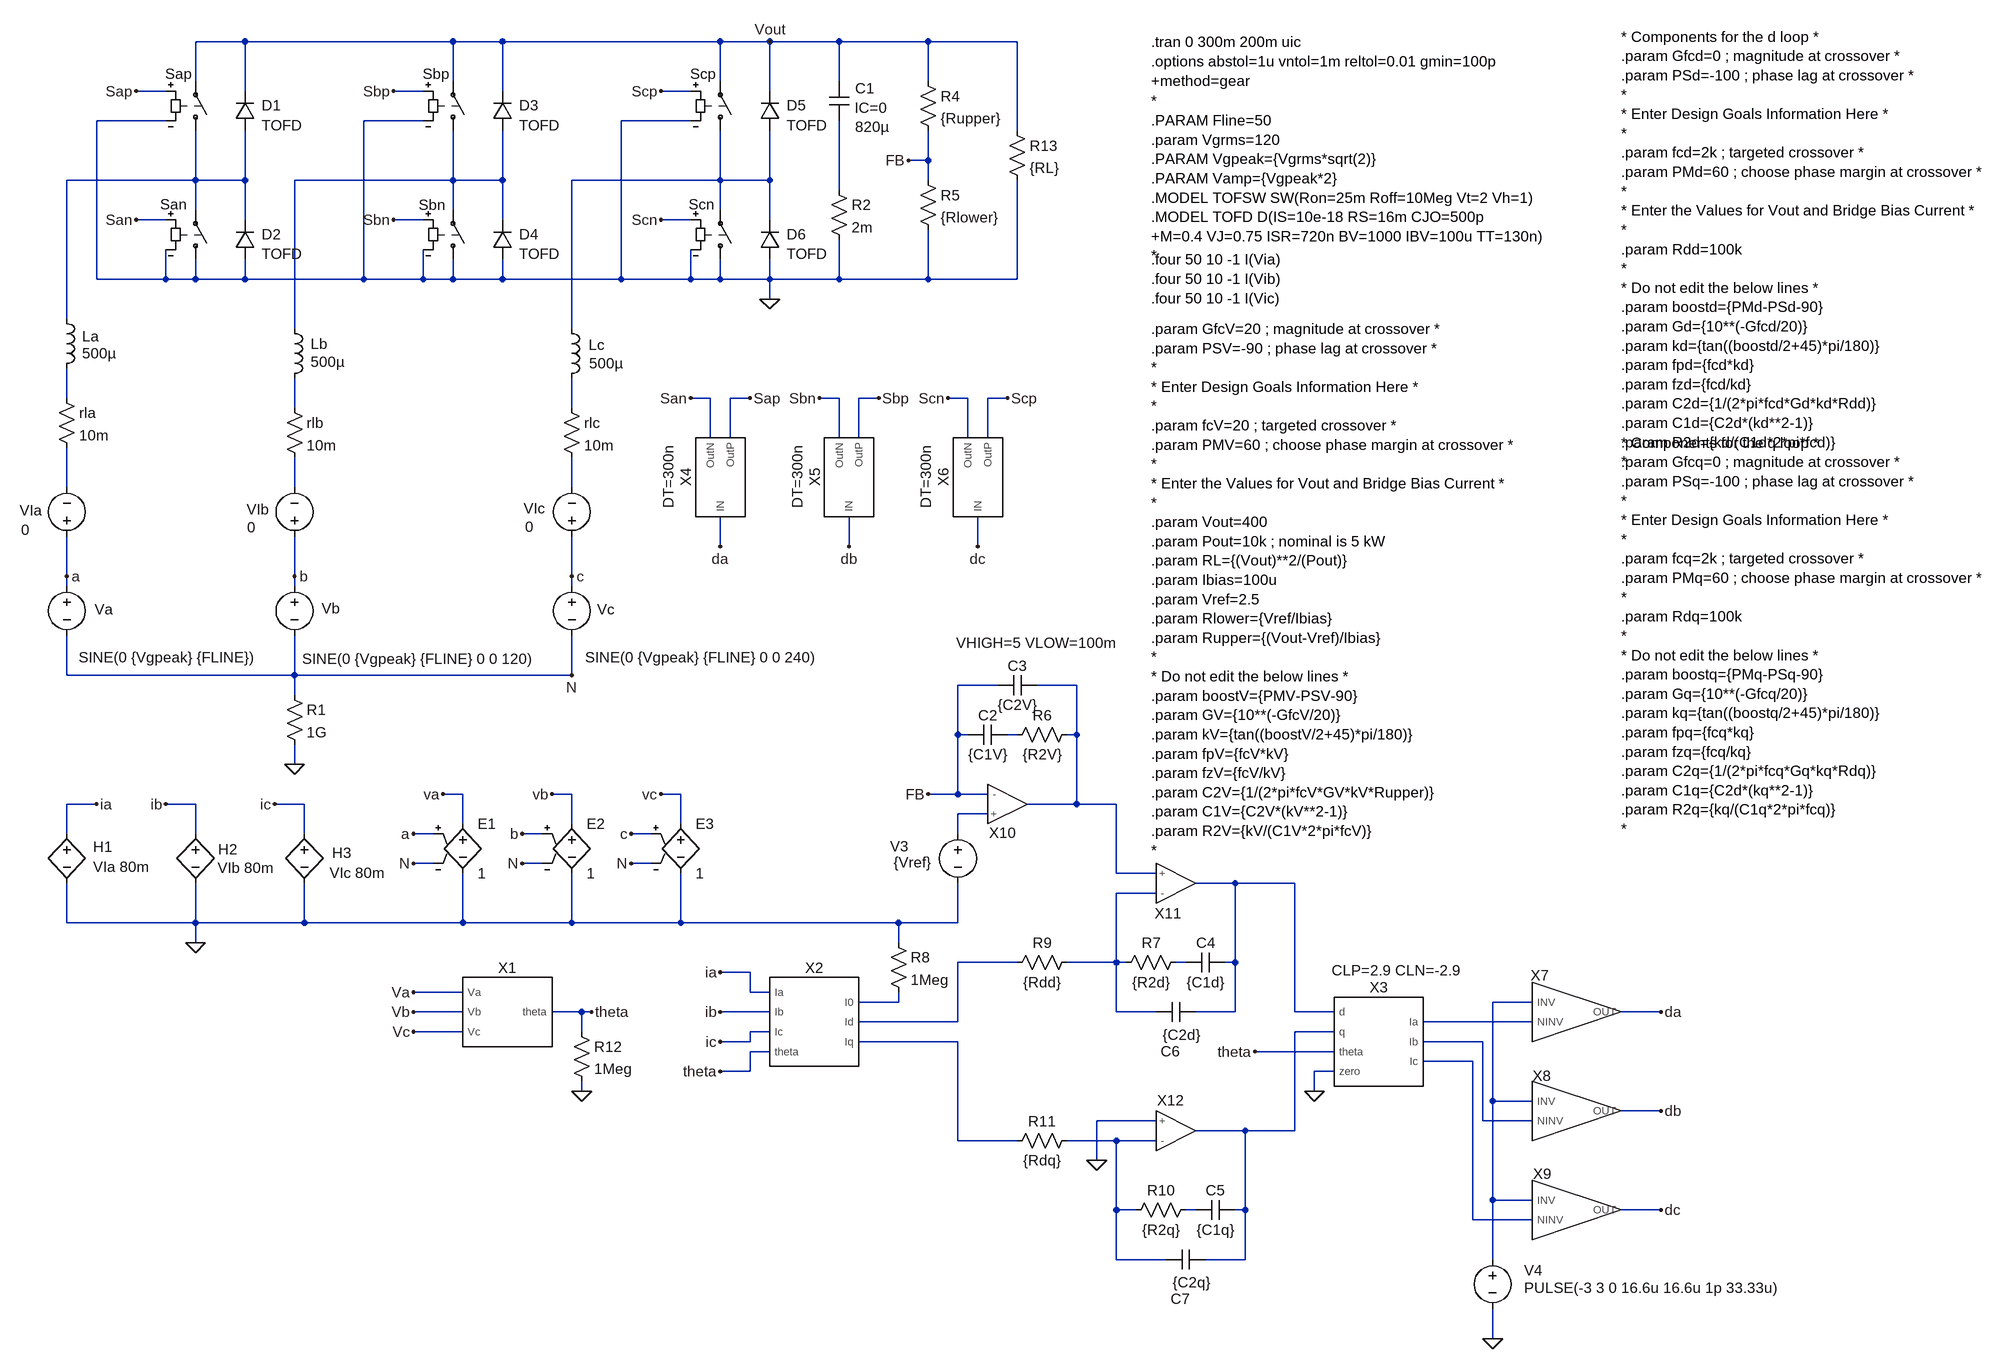
[diagram p0: schematic 3-phase PFC with switches.asc]
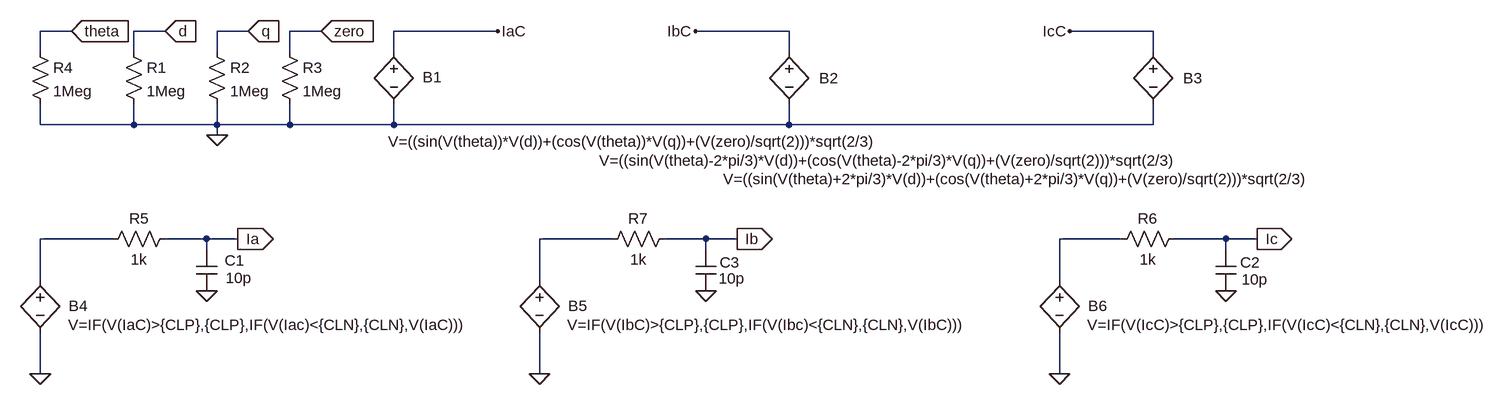
[diagram p1: sub-circuit inverse_dq0.asc]
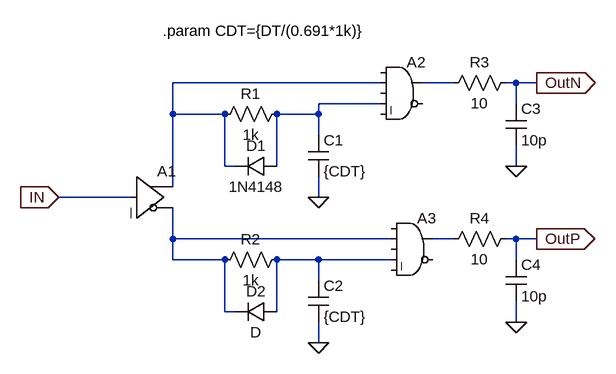
[diagram p2: sub-circuit dt_driver.asc]
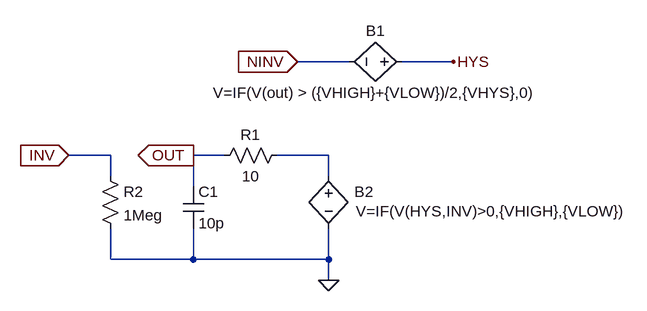
[diagram p3: sub-circuit comptof.asc]
3-phase PFC with switches.asc, the LTspice schematic file:
Version 4
SHEET 1 4316 1596
WIRE 320 -688 240 -688
WIRE 656 -688 320 -688
WIRE 736 -688 656 -688
WIRE 1088 -688 736 -688
WIRE 1168 -688 1088 -688
WIRE 1280 -688 1168 -688
WIRE 1424 -688 1280 -688
WIRE 1568 -688 1424 -688
WIRE 240 -624 240 -688
WIRE 656 -624 656 -688
WIRE 1088 -624 1088 -688
WIRE 1280 -624 1280 -688
WIRE 1424 -624 1424 -688
WIRE 192 -608 144 -608
WIRE 320 -608 320 -688
WIRE 608 -608 560 -608
WIRE 736 -608 736 -688
WIRE 1040 -608 992 -608
WIRE 1168 -608 1168 -688
WIRE 192 -560 80 -560
WIRE 608 -560 512 -560
WIRE 1040 -560 928 -560
WIRE 1568 -544 1568 -688
WIRE 1424 -496 1424 -544
WIRE 1424 -496 1392 -496
WIRE 240 -464 240 -544
WIRE 240 -464 32 -464
WIRE 320 -464 320 -544
WIRE 320 -464 240 -464
WIRE 656 -464 656 -544
WIRE 656 -464 400 -464
WIRE 736 -464 736 -544
WIRE 736 -464 656 -464
WIRE 1088 -464 1088 -544
WIRE 1088 -464 848 -464
WIRE 1168 -464 1168 -544
WIRE 1168 -464 1088 -464
WIRE 1424 -464 1424 -496
WIRE 1280 -448 1280 -560
WIRE 240 -416 240 -464
WIRE 656 -416 656 -464
WIRE 1088 -416 1088 -464
WIRE 192 -400 144 -400
WIRE 320 -400 320 -464
WIRE 608 -400 560 -400
WIRE 736 -400 736 -464
WIRE 1040 -400 992 -400
WIRE 1168 -400 1168 -464
WIRE 80 -304 80 -560
WIRE 192 -304 192 -352
WIRE 192 -304 80 -304
WIRE 240 -304 240 -336
WIRE 240 -304 192 -304
WIRE 320 -304 320 -336
WIRE 320 -304 240 -304
WIRE 512 -304 512 -560
WIRE 512 -304 320 -304
WIRE 608 -304 608 -352
WIRE 608 -304 512 -304
WIRE 656 -304 656 -336
WIRE 656 -304 608 -304
WIRE 736 -304 736 -336
WIRE 736 -304 656 -304
WIRE 928 -304 928 -560
WIRE 928 -304 736 -304
WIRE 1040 -304 1040 -352
WIRE 1040 -304 928 -304
WIRE 1088 -304 1088 -336
WIRE 1088 -304 1040 -304
WIRE 1168 -304 1168 -336
WIRE 1168 -304 1088 -304
WIRE 1280 -304 1280 -368
WIRE 1280 -304 1168 -304
WIRE 1424 -304 1424 -384
WIRE 1424 -304 1280 -304
WIRE 1568 -304 1568 -464
WIRE 1568 -304 1424 -304
WIRE 1168 -272 1168 -304
WIRE 32 -240 32 -464
WIRE 400 -224 400 -464
WIRE 848 -224 848 -464
WIRE 32 -112 32 -160
WIRE 1072 -112 1040 -112
WIRE 1136 -112 1104 -112
WIRE 1280 -112 1248 -112
WIRE 1344 -112 1312 -112
WIRE 1488 -112 1456 -112
WIRE 1552 -112 1520 -112
WIRE 400 -96 400 -144
WIRE 848 -96 848 -144
WIRE 1072 -48 1072 -112
WIRE 1104 -48 1104 -112
WIRE 1280 -48 1280 -112
WIRE 1312 -48 1312 -112
WIRE 1488 -48 1488 -112
WIRE 1520 -48 1520 -112
WIRE 32 32 32 -32
WIRE 400 32 400 -16
WIRE 848 32 848 -16
WIRE 1088 128 1088 80
WIRE 1296 128 1296 80
WIRE 1504 128 1504 80
WIRE 32 176 32 112
WIRE 400 176 400 112
WIRE 848 176 848 112
WIRE 32 192 32 176
WIRE 400 192 400 176
WIRE 848 192 848 176
WIRE 32 336 32 272
WIRE 400 336 400 272
WIRE 400 336 32 336
WIRE 848 336 848 272
WIRE 848 336 400 336
WIRE 1536 352 1472 352
WIRE 1664 352 1600 352
WIRE 400 368 400 336
WIRE 1472 432 1472 352
WIRE 1488 432 1472 432
WIRE 1568 432 1552 432
WIRE 1664 432 1664 352
WIRE 1664 432 1648 432
WIRE 400 480 400 448
WIRE 672 528 640 528
WIRE 848 528 816 528
WIRE 1024 528 992 528
WIRE 1472 528 1472 432
WIRE 1472 528 1424 528
WIRE 1520 528 1472 528
WIRE 80 544 32 544
WIRE 240 544 192 544
WIRE 416 544 368 544
WIRE 1664 544 1664 432
WIRE 1664 544 1584 544
WIRE 1728 544 1664 544
WIRE 1520 560 1472 560
WIRE 672 576 672 528
WIRE 848 576 848 528
WIRE 1024 576 1024 528
WIRE 32 592 32 544
WIRE 240 592 240 544
WIRE 416 592 416 544
WIRE 624 592 592 592
WIRE 800 592 768 592
WIRE 976 592 944 592
WIRE 1472 592 1472 560
WIRE 624 640 592 640
WIRE 800 640 768 640
WIRE 976 640 944 640
WIRE 1728 656 1728 544
WIRE 1792 656 1728 656
WIRE 1920 672 1856 672
WIRE 2016 672 1920 672
WIRE 1792 688 1728 688
WIRE 32 736 32 672
WIRE 240 736 240 672
WIRE 240 736 32 736
WIRE 416 736 416 672
WIRE 416 736 240 736
WIRE 672 736 672 656
WIRE 672 736 416 736
WIRE 848 736 848 656
WIRE 848 736 672 736
WIRE 1024 736 1024 656
WIRE 1024 736 848 736
WIRE 1376 736 1024 736
WIRE 1472 736 1472 672
WIRE 1472 736 1376 736
WIRE 240 768 240 736
WIRE 1376 768 1376 736
WIRE 1568 800 1472 800
WIRE 1728 800 1728 688
WIRE 1728 800 1648 800
WIRE 1744 800 1728 800
WIRE 1840 800 1824 800
WIRE 1920 800 1920 672
WIRE 1920 800 1904 800
WIRE 1136 816 1088 816
WIRE 672 848 592 848
WIRE 1136 848 1136 816
WIRE 1168 848 1136 848
WIRE 1376 864 1376 848
WIRE 1376 864 1312 864
WIRE 2400 864 2336 864
WIRE 672 880 592 880
WIRE 864 880 816 880
WIRE 880 880 864 880
WIRE 1168 880 1088 880
WIRE 1728 880 1728 800
WIRE 1792 880 1728 880
WIRE 1920 880 1920 800
WIRE 1920 880 1856 880
WIRE 2016 880 2016 672
WIRE 2080 880 2016 880
WIRE 2608 880 2544 880
WIRE 1472 896 1472 800
WIRE 1472 896 1312 896
WIRE 2400 896 2224 896
WIRE 672 912 592 912
WIRE 864 912 864 880
WIRE 1168 912 1136 912
WIRE 2080 912 2016 912
WIRE 1136 928 1136 912
WIRE 1136 928 1088 928
WIRE 1472 928 1312 928
WIRE 2320 928 2224 928
WIRE 1168 944 1136 944
WIRE 2080 944 1952 944
WIRE 2304 960 2224 960
WIRE 1136 976 1136 944
WIRE 1136 976 1088 976
WIRE 2080 976 2048 976
WIRE 864 1008 864 992
WIRE 2048 1008 2048 976
WIRE 2336 1024 2336 864
WIRE 2400 1024 2336 1024
WIRE 2608 1040 2544 1040
WIRE 1792 1056 1696 1056
WIRE 2320 1056 2320 928
WIRE 2400 1056 2320 1056
WIRE 1936 1072 1856 1072
WIRE 2016 1072 2016 912
WIRE 2016 1072 1936 1072
WIRE 1472 1088 1472 928
WIRE 1568 1088 1472 1088
WIRE 1728 1088 1648 1088
WIRE 1792 1088 1728 1088
WIRE 1696 1120 1696 1056
WIRE 2336 1184 2336 1024
WIRE 2400 1184 2336 1184
WIRE 1728 1200 1728 1088
WIRE 1760 1200 1728 1200
WIRE 1856 1200 1840 1200
WIRE 1936 1200 1936 1072
WIRE 1936 1200 1920 1200
WIRE 2608 1200 2544 1200
WIRE 2304 1216 2304 960
WIRE 2400 1216 2304 1216
WIRE 1728 1280 1728 1200
WIRE 1808 1280 1728 1280
WIRE 1936 1280 1936 1200
WIRE 1936 1280 1872 1280
WIRE 2336 1280 2336 1184
WIRE 2336 1408 2336 1360
FLAG 400 480 0
FLAG 80 544 ia
FLAG 192 544 ib
FLAG 368 544 ic
FLAG 32 176 a
FLAG 400 176 b
FLAG 848 176 c
FLAG 240 768 0
FLAG 144 -608 Sap
FLAG 144 -400 San
FLAG 560 -608 Sbp
FLAG 560 -400 Sbn
FLAG 992 -608 Scp
FLAG 992 -400 Scn
FLAG 1392 -496 FB
FLAG 1168 -688 Vout
FLAG 640 528 va
FLAG 848 336 N
FLAG 592 640 N
FLAG 592 592 a
FLAG 816 528 vb
FLAG 768 640 N
FLAG 768 592 b
FLAG 992 528 vc
FLAG 944 640 N
FLAG 944 592 c
FLAG 1168 -272 0
FLAG 880 880 theta
FLAG 592 848 Va
FLAG 592 880 Vb
FLAG 592 912 Vc
FLAG 1088 816 ia
FLAG 1088 880 ib
FLAG 1088 928 ic
FLAG 1088 976 theta
FLAG 1424 528 FB
FLAG 1696 1120 0
FLAG 1952 944 theta
FLAG 2048 1008 0
FLAG 2336 1408 0
FLAG 2608 880 da
FLAG 2608 1040 db
FLAG 2608 1200 dc
FLAG 1088 128 da
FLAG 1040 -112 San
FLAG 1136 -112 Sap
FLAG 1296 128 db
FLAG 1248 -112 Sbn
FLAG 1344 -112 Sbp
FLAG 1504 128 dc
FLAG 1456 -112 Scn
FLAG 1552 -112 Scp
FLAG 864 1008 0
SYMBOL voltage 32 176 R0
WINDOW 0 45 53 Left 2
WINDOW 3 19 131 Left 2
WINDOW 123 0 0 Left 0
WINDOW 39 0 0 Left 0
SYMATTR InstName Va
SYMATTR Value SINE(0 {Vgpeak} {FLINE})
SYMBOL voltage 400 176 R0
WINDOW 0 44 52 Left 2
WINDOW 3 12 133 Left 2
WINDOW 123 0 0 Left 0
WINDOW 39 0 0 Left 0
SYMATTR InstName Vb
SYMATTR Value SINE(0 {Vgpeak} {FLINE} 0 0 120)
SYMBOL voltage 848 176 R0
WINDOW 0 41 53 Left 2
WINDOW 3 22 131 Left 2
WINDOW 123 0 0 Left 0
WINDOW 39 0 0 Left 0
SYMATTR InstName Vc
SYMATTR Value SINE(0 {Vgpeak} {FLINE} 0 0 240)
SYMBOL res 384 352 R0
SYMATTR InstName R1
SYMATTR Value 1G
SYMBOL res 16 -128 R0
SYMATTR InstName rla
SYMATTR Value 10m
SYMBOL res 384 -112 R0
SYMATTR InstName rlb
SYMATTR Value 10m
SYMBOL res 832 -112 R0
SYMATTR InstName rlc
SYMATTR Value 10m
SYMBOL h 32 576 R0
WINDOW 0 43 37 Left 2
WINDOW 3 43 69 Left 2
SYMATTR InstName H1
SYMATTR Value VIa 80m
SYMBOL h 240 576 R0
WINDOW 0 37 41 Left 2
WINDOW 3 36 71 Left 2
SYMATTR InstName H2
SYMATTR Value VIb 80m
SYMBOL h 416 576 R0
WINDOW 0 45 47 Left 2
WINDOW 3 41 79 Left 2
SYMATTR InstName H3
SYMATTR Value VIc 80m
SYMBOL ind 16 -256 R0
WINDOW 0 41 44 Left 2
WINDOW 3 41 72 Left 2
SYMATTR InstName La
SYMATTR Value 500µ
SYMBOL ind 384 -240 R0
WINDOW 0 42 40 Left 2
WINDOW 3 42 69 Left 2
SYMATTR InstName Lb
SYMATTR Value 500µ
SYMBOL ind 832 -240 R0
WINDOW 0 43 42 Left 2
WINDOW 3 44 72 Left 2
SYMATTR InstName Lc
SYMATTR Value 500µ
SYMBOL voltage 32 128 R180
WINDOW 0 40 59 Left 2
WINDOW 3 60 27 Left 2
WINDOW 123 0 0 Left 0
WINDOW 39 0 0 Left 0
SYMATTR InstName VIa
SYMATTR Value 0
SYMBOL voltage 400 128 R180
WINDOW 0 41 60 Left 2
WINDOW 3 63 31 Left 2
WINDOW 123 0 0 Left 0
WINDOW 39 0 0 Left 0
SYMATTR InstName VIb
SYMATTR Value 0
SYMBOL voltage 848 128 R180
WINDOW 0 43 62 Left 2
WINDOW 3 62 32 Left 2
WINDOW 123 0 0 Left 0
WINDOW 39 0 0 Left 0
SYMATTR InstName VIc
SYMATTR Value 0
SYMBOL sw 240 -528 M180
WINDOW 3 47 44 Invisible 2
WINDOW 0 -49 108 Left 2
SYMATTR Value TOFSW
SYMATTR InstName Sap
SYMBOL sw 240 -320 M180
WINDOW 3 41 43 Invisible 2
WINDOW 0 -57 105 Left 2
SYMATTR Value TOFSW
SYMATTR InstName San
SYMBOL sw 656 -528 M180
WINDOW 3 47 44 Invisible 2
WINDOW 0 -49 108 Left 2
SYMATTR Value TOFSW
SYMATTR InstName Sbp
SYMBOL sw 656 -320 M180
WINDOW 3 41 43 Invisible 2
WINDOW 0 -55 104 Left 2
SYMATTR Value TOFSW
SYMATTR InstName Sbn
SYMBOL sw 1088 -528 M180
WINDOW 3 47 44 Invisible 2
WINDOW 0 -49 108 Left 2
SYMATTR Value TOFSW
SYMATTR InstName Scp
SYMBOL sw 1088 -320 M180
WINDOW 3 41 43 Invisible 2
WINDOW 0 -51 105 Left 2
SYMATTR Value TOFSW
SYMATTR InstName Scn
SYMBOL cap 1264 -624 R0
WINDOW 0 42 11 Left 2
WINDOW 3 42 74 Left 2
WINDOW 123 41 43 Left 2
SYMATTR InstName C1
SYMATTR Value 820µ
SYMATTR Value2 IC=0
SYMBOL res 1264 -464 R0
SYMATTR InstName R2
SYMATTR Value 2m
SYMBOL res 1408 -640 R0
SYMATTR InstName R4
SYMATTR Value {Rupper}
SYMBOL res 1408 -480 R0
SYMATTR InstName R5
SYMATTR Value {Rlower}
SYMBOL e 672 560 R0
SYMATTR InstName E1
SYMATTR Value 1
SYMBOL e 848 560 R0
SYMATTR InstName E2
SYMATTR Value 1
SYMBOL e 1024 560 R0
SYMATTR InstName E3
SYMATTR Value 1
SYMBOL theta_sub 736 880 R0
SYMATTR InstName X1
SYMBOL dq0_sub 1232 896 R0
SYMATTR InstName X2
SYMBOL res 1664 416 R90
WINDOW 0 0 56 VBottom 2
WINDOW 3 32 56 VTop 2
SYMATTR InstName R6
SYMATTR Value {R2V}
SYMBOL cap 1552 416 R90
WINDOW 0 0 32 VBottom 2
WINDOW 3 32 32 VTop 2
SYMATTR InstName C2
SYMATTR Value {C1V}
SYMBOL cap 1600 336 R90
WINDOW 0 0 32 VBottom 2
WINDOW 3 32 32 VTop 2
SYMATTR InstName C3
SYMATTR Value {C2V}
SYMBOL voltage 1472 576 M0
WINDOW 0 80 36 Left 2
WINDOW 3 43 62 Left 2
SYMATTR InstName V3
SYMATTR Value {Vref}
SYMBOL res 1728 816 R270
WINDOW 0 32 56 VTop 2
WINDOW 3 0 56 VBottom 2
SYMATTR InstName R7
SYMATTR Value {R2d}
SYMBOL cap 1840 816 R270
WINDOW 0 32 32 VTop 2
WINDOW 3 0 32 VBottom 2
SYMATTR InstName C4
SYMATTR Value {C1d}
SYMBOL cap 1792 896 R270
WINDOW 0 -63 23 VTop 2
WINDOW 3 -5 41 VBottom 2
SYMATTR InstName C6
SYMATTR Value {C2d}
SYMBOL res 1360 752 R0
SYMATTR InstName R8
SYMATTR Value 1Meg
SYMBOL res 1664 784 R90
WINDOW 0 0 56 VBottom 2
WINDOW 3 32 56 VTop 2
SYMATTR InstName R9
SYMATTR Value {Rdd}
SYMBOL res 1744 1216 R270
WINDOW 0 32 56 VTop 2
WINDOW 3 0 56 VBottom 2
SYMATTR InstName R10
SYMATTR Value {R2q}
SYMBOL cap 1856 1216 R270
WINDOW 0 32 32 VTop 2
WINDOW 3 0 32 VBottom 2
SYMATTR InstName C5
SYMATTR Value {C1q}
SYMBOL cap 1808 1296 R270
WINDOW 0 -63 23 VTop 2
WINDOW 3 -5 41 VBottom 2
SYMATTR InstName C7
SYMATTR Value {C2q}
SYMBOL res 1664 1072 R90
WINDOW 0 0 56 VBottom 2
WINDOW 3 32 56 VTop 2
SYMATTR InstName R11
SYMATTR Value {Rdq}
SYMBOL Inverse_dq0 2144 928 R0
WINDOW 39 35 -100 Bottom 2
SYMATTR SpiceLine CLP=2.9 CLN=-2.9
SYMATTR InstName X3
SYMBOL voltage 2336 1264 R0
WINDOW 123 0 0 Left 0
WINDOW 39 0 0 Left 0
WINDOW 0 51 33 Left 2
WINDOW 3 51 62 Left 2
SYMATTR InstName V4
SYMATTR Value PULSE(-3 3 0 16.6u 16.6u 1p 33.33u)
SYMBOL DT_driver 1088 16 R270
WINDOW 39 0 -68 Bottom 2
SYMATTR SpiceLine DT=300n
SYMATTR InstName X4
SYMBOL DT_driver 1296 16 R270
WINDOW 39 0 -68 Bottom 2
SYMATTR SpiceLine DT=300n
SYMATTR InstName X5
SYMBOL DT_driver 1504 16 R270
WINDOW 39 0 -68 Bottom 2
SYMATTR SpiceLine DT=300n
SYMATTR InstName X6
SYMBOL res 848 896 R0
SYMATTR InstName R12
SYMATTR Value 1Meg
SYMBOL COMPTOF 2464 880 R0
WINDOW 0 -52 -44 Bottom 2
SYMATTR InstName X7
SYMATTR SpiceLine VHIGH=5 VLOW=100m VHYS=10m
SYMBOL COMPTOF 2464 1040 R0
WINDOW 0 -49 -41 Bottom 2
SYMATTR InstName X8
SYMATTR SpiceLine VHIGH=5 VLOW=100m VHYS=10m
SYMBOL COMPTOF 2464 1200 R0
WINDOW 0 -48 -43 Bottom 2
SYMATTR InstName X9
SYMATTR SpiceLine VHIGH=5 VLOW=100m VHYS=10m
SYMBOL opampTOF 1584 528 R0
WINDOW 0 -40 78 Bottom 2
WINDOW 39 13 -229 Bottom 2
SYMATTR InstName X10
SYMATTR SpiceLine VHIGH=5 VLOW=100m
SYMBOL opampTOF 1856 688 M180
WINDOW 0 -45 -17 Bottom 2
SYMATTR InstName X11
SYMATTR SpiceLine VHIGH=5 VLOW=-5
SYMBOL opampTOF 1856 1088 M180
WINDOW 0 -41 81 Bottom 2
SYMATTR InstName X12
SYMATTR SpiceLine VHIGH=5 VLOW=-5
SYMBOL res 1552 -560 R0
SYMATTR InstName R13
SYMATTR Value {RL}
SYMBOL diode 304 -544 M180
WINDOW 0 43 41 Left 2
WINDOW 3 43 9 Left 2
SYMATTR InstName D1
SYMATTR Value TOFD
SYMBOL diode 304 -336 M180
WINDOW 0 43 41 Left 2
WINDOW 3 43 9 Left 2
SYMATTR InstName D2
SYMATTR Value TOFD
SYMBOL diode 720 -544 M180
WINDOW 0 43 41 Left 2
WINDOW 3 43 9 Left 2
SYMATTR InstName D3
SYMATTR Value TOFD
SYMBOL diode 720 -336 M180
WINDOW 0 43 41 Left 2
WINDOW 3 43 9 Left 2
SYMATTR InstName D4
SYMATTR Value TOFD
SYMBOL diode 1152 -544 M180
WINDOW 0 43 41 Left 2
WINDOW 3 43 9 Left 2
SYMATTR InstName D5
SYMATTR Value TOFD
SYMBOL diode 1152 -336 M180
WINDOW 0 43 41 Left 2
WINDOW 3 43 9 Left 2
SYMATTR InstName D6
SYMATTR Value TOFD
TEXT 1784 -592 Left 2 !*\n.PARAM Fline=50\n.param Vgrms=120\n.PARAM Vgpeak={Vgrms*sqrt(2)}\n.PARAM Vamp={Vgpeak*2}\n.MODEL TOFSW SW(Ron=25m Roff=10Meg Vt=2 Vh=1)\n.MODEL TOFD D(IS=10e-18 RS=16m CJO=500p \n+M=0.4 VJ=0.75 ISR=720n BV=1000 IBV=100u TT=130n)\n*
TEXT 1784 -688 Left 2 !.tran 0 300m 200m uic
TEXT 1784 -224 Left 2 !.param GfcV=20 ; magnitude at crossover *\n.param PSV=-90 ; phase lag at crossover *\n*\n* Enter Design Goals Information Here *\n*\n.param fcV=20 ; targeted crossover *\n.param PMV=60 ; choose phase margin at crossover *\n*\n* Enter the Values for Vout and Bridge Bias Current *\n*\n.param Vout=400\n.param Pout=10k ; nominal is 5 kW\n.param RL={(Vout)**2/(Pout)}\n.param Ibias=100u\n.param Vref=2.5\n.param Rlower={Vref/Ibias}\n.param Rupper={(Vout-Vref)/Ibias}\n*\n* Do not edit the below lines *\n.param boostV={PMV-PSV-90}\n.param GV={10**(-GfcV/20)}\n.param kV={tan((boostV/2+45)*pi/180)}\n.param fpV={fcV*kV}\n.param fzV={fcV/kV}\n.param C2V={1/(2*pi*fcV*GV*kV*Rupper)}\n.param C1V={C2V*(kV**2-1)}\n.param R2V={kV/(C1V*2*pi*fcV)}\n*
TEXT 2544 -696 Left 2 !* Components for the d loop *\n.param Gfcd=0 ; magnitude at crossover *\n.param PSd=-100 ; phase lag at crossover *\n*\n* Enter Design Goals Information Here *\n*\n.param fcd=2k ; targeted crossover *\n.param PMd=60 ; choose phase margin at crossover *\n*\n* Enter the Values for Vout and Bridge Bias Current *\n*\n.param Rdd=100k\n*\n* Do not edit the below lines *\n.param boostd={PMd-PSd-90}\n.param Gd={10**(-Gfcd/20)}\n.param kd={tan((boostd/2+45)*pi/180)}\n.param fpd={fcd*kd}\n.param fzd={fcd/kd}\n.param C2d={1/(2*pi*fcd*Gd*kd*Rdd)}\n.param C1d={C2d*(kd**2-1)}\n.param R2d={kd/(C1d*2*pi*fcd)}\n*
TEXT 2544 -40 Left 2 !* Components for the q loop *\n.param Gfcq=0 ; magnitude at crossover *\n.param PSq=-100 ; phase lag at crossover *\n*\n* Enter Design Goals Information Here *\n*\n.param fcq=2k ; targeted crossover *\n.param PMq=60 ; choose phase margin at crossover *\n*\n.param Rdq=100k\n*\n* Do not edit the below lines *\n.param boostq={PMq-PSq-90}\n.param Gq={10**(-Gfcq/20)}\n.param kq={tan((boostq/2+45)*pi/180)}\n.param fpq={fcq*kq}\n.param fzq={fcq/kq}\n.param C2q={1/(2*pi*fcq*Gq*kq*Rdq)}\n.param C1q={C2d*(kq**2-1)}\n.param R2q={kq/(C1q*2*pi*fcq)}\n*
TEXT 1784 -336 Left 2 !.four 50 10 -1 I(Via)\n.four 50 10 -1 I(Vib)\n.four 50 10 -1 I(Vic)
TEXT 1784 -656 Left 2 !.options abstol=1u vntol=1m reltol=0.01 gmin=100p\n+method=gear

inverse_dq0.asc, the sub-circuit schematic file:
Version 4
SHEET 1 1804 980
WIRE -464 16 -512 16
WIRE -320 16 -368 16
WIRE -192 16 -240 16
WIRE -80 16 -128 16
WIRE 192 16 32 16
WIRE 640 16 496 16
WIRE 1200 16 1072 16
WIRE -512 48 -512 16
WIRE -368 48 -368 16
WIRE -240 48 -240 16
WIRE -128 48 -128 16
WIRE 32 48 32 16
WIRE 640 48 640 16
WIRE 1200 48 1200 16
WIRE -512 160 -512 128
WIRE -368 160 -368 128
WIRE -368 160 -512 160
WIRE -240 160 -240 128
WIRE -240 160 -368 160
WIRE -128 160 -128 128
WIRE -128 160 -240 160
WIRE 32 160 32 128
WIRE 32 160 -128 160
WIRE 640 160 640 128
WIRE 640 160 32 160
WIRE 1200 160 1200 128
WIRE 1200 160 640 160
WIRE -240 176 -240 160
WIRE -400 336 -512 336
WIRE -256 336 -320 336
WIRE -208 336 -256 336
WIRE 368 336 256 336
WIRE 512 336 448 336
WIRE 560 336 512 336
WIRE 1152 336 1056 336
WIRE 1312 336 1232 336
WIRE 1360 336 1312 336
WIRE -256 352 -256 336
WIRE 512 352 512 336
WIRE 1312 352 1312 336
WIRE -512 400 -512 336
WIRE 256 400 256 336
WIRE 1056 400 1056 336
WIRE -512 544 -512 480
WIRE 256 544 256 480
WIRE 1056 544 1056 480
FLAG -240 176 0
FLAG -320 16 d
IOPIN -320 16 In
FLAG -192 16 q
IOPIN -192 16 In
FLAG -80 16 zero
IOPIN -80 16 In
FLAG 192 16 IaC
FLAG 496 16 IbC
FLAG 1072 16 IcC
FLAG -464 16 theta
IOPIN -464 16 In
FLAG -208 336 Ia
IOPIN -208 336 Out
FLAG -512 544 0
FLAG 560 336 Ib
IOPIN 560 336 Out
FLAG 256 544 0
FLAG 1360 336 Ic
IOPIN 1360 336 Out
FLAG 1056 544 0
FLAG -256 416 0
FLAG 1312 416 0
FLAG 512 416 0
SYMBOL res -384 32 R0
SYMATTR InstName R1
SYMATTR Value 1Meg
SYMBOL res -256 32 R0
SYMATTR InstName R2
SYMATTR Value 1Meg
SYMBOL res -144 32 R0
SYMATTR InstName R3
SYMATTR Value 1Meg
SYMBOL bv 32 32 R0
WINDOW 0 44 55 Left 2
WINDOW 3 -9 154 Left 2
SYMATTR InstName B1
SYMATTR Value V=((sin(V(theta))*V(d))+(cos(V(theta))*V(q))+(V(zero)/sqrt(2)))*sqrt(2/3)
SYMBOL bv 640 32 R0
WINDOW 0 46 56 Left 2
WINDOW 3 -292 183 Left 2
SYMATTR InstName B2
SYMATTR Value V=((sin(V(theta)-2*pi/3)*V(d))+(cos(V(theta)-2*pi/3)*V(q))+(V(zero)/sqrt(2)))*sqrt(2/3)
SYMBOL res -528 32 R0
SYMATTR InstName R4
SYMATTR Value 1Meg
SYMBOL bv 1200 32 R0
WINDOW 0 46 56 Left 2
WINDOW 3 -661 212 Left 2
SYMATTR InstName B3
SYMATTR Value V=((sin(V(theta)+2*pi/3)*V(d))+(cos(V(theta)+2*pi/3)*V(q))+(V(zero)/sqrt(2)))*sqrt(2/3)
SYMBOL bv -512 384 R0
WINDOW 0 44 55 Left 2
WINDOW 3 43 84 Left 2
SYMATTR InstName B4
SYMATTR Value V=IF(V(IaC)>{CLP},{CLP},IF(V(Iac)<{CLN},{CLN},V(IaC)))
SYMBOL bv 256 384 R0
WINDOW 0 44 55 Left 2
WINDOW 3 43 84 Left 2
SYMATTR InstName B5
SYMATTR Value V=IF(V(IbC)>{CLP},{CLP},IF(V(Ibc)<{CLN},{CLN},V(IbC)))
SYMBOL bv 1056 384 R0
WINDOW 0 44 55 Left 2
WINDOW 3 43 84 Left 2
SYMATTR InstName B6
SYMATTR Value V=IF(V(IcC)>{CLP},{CLP},IF(V(IcC)<{CLN},{CLN},V(IcC)))
SYMBOL res -304 320 R90
WINDOW 0 0 56 VBottom 2
WINDOW 3 32 56 VTop 2
SYMATTR InstName R5
SYMATTR Value 1k
SYMBOL res 1248 320 R90
WINDOW 0 0 56 VBottom 2
WINDOW 3 32 56 VTop 2
SYMATTR InstName R6
SYMATTR Value 1k
SYMBOL res 464 320 R90
WINDOW 0 0 56 VBottom 2
WINDOW 3 32 56 VTop 2
SYMATTR InstName R7
SYMATTR Value 1k
SYMBOL cap -272 352 R0
WINDOW 0 44 17 Left 2
WINDOW 3 45 44 Left 2
SYMATTR InstName C1
SYMATTR Value 10p
SYMBOL cap 1296 352 R0
WINDOW 0 38 20 Left 2
WINDOW 3 40 46 Left 2
SYMATTR InstName C2
SYMATTR Value 10p
SYMBOL cap 496 352 R0
WINDOW 0 37 20 Left 2
WINDOW 3 36 45 Left 2
SYMATTR InstName C3
SYMATTR Value 10p

dt_driver.asc, the sub-circuit schematic file:
Version 4
SHEET 1 880 680
WIRE 480 32 160 32
WIRE 592 32 544 32
WIRE 688 32 672 32
WIRE 720 32 688 32
WIRE 480 64 384 64
WIRE 688 64 688 32
WIRE 160 80 160 32
WIRE 240 80 160 80
WIRE 384 80 384 64
WIRE 384 80 320 80
WIRE 384 112 384 80
WIRE 240 160 240 80
WIRE 256 160 240 160
WIRE 320 160 320 80
WIRE 688 160 688 128
WIRE 160 192 160 80
WIRE 96 208 -16 208
WIRE 384 208 384 176
WIRE 160 272 160 224
WIRE 496 272 160 272
WIRE 592 272 560 272
WIRE 688 272 672 272
WIRE 720 272 688 272
WIRE 160 304 160 272
WIRE 240 304 160 304
WIRE 384 304 320 304
WIRE 496 304 384 304
WIRE 688 304 688 272
WIRE 384 336 384 304
WIRE 240 384 240 304
WIRE 256 384 240 384
WIRE 320 384 320 304
WIRE 688 400 688 368
WIRE 384 432 384 400
FLAG 384 208 0
FLAG 384 432 0
FLAG 720 32 OutN
IOPIN 720 32 Out
FLAG 720 272 OutP
IOPIN 720 272 Out
FLAG -16 208 IN
IOPIN -16 208 In
FLAG 688 160 0
FLAG 688 400 0
SYMBOL Digital\\buf 96 144 R0
SYMATTR InstName A1
SYMATTR SpiceLine Vhigh=5 Vlow=0 Ref=1.0
SYMBOL res 336 64 R90
WINDOW 0 0 56 VBottom 2
WINDOW 3 32 56 VTop 2
SYMATTR InstName R1
SYMATTR Value 1k
SYMBOL cap 368 112 R0
SYMATTR InstName C1
SYMATTR Value {CDT}
SYMBOL res 336 288 R90
WINDOW 0 0 56 VBottom 2
WINDOW 3 32 56 VTop 2
SYMATTR InstName R2
SYMATTR Value 1k
SYMBOL cap 368 336 R0
SYMATTR InstName C2
SYMATTR Value {CDT}
SYMBOL Digital\\and 512 -16 R0
SYMATTR InstName A2
SYMATTR SpiceLine Vhigh=5 Vlow=0 Ref=2.5
SYMBOL Digital\\and 528 224 R0
SYMATTR InstName A3
SYMATTR SpiceLine Vhigh=5 Vlow=0 Ref=2.5
SYMBOL diode 320 144 R90
WINDOW 0 0 32 VBottom 2
WINDOW 3 32 32 VTop 2
SYMATTR InstName D1
SYMATTR Value 1N4148
SYMBOL diode 320 368 R90
WINDOW 0 0 32 VBottom 2
WINDOW 3 32 32 VTop 2
SYMATTR InstName D2
SYMBOL res 688 16 R90
WINDOW 0 0 56 VBottom 2
WINDOW 3 32 56 VTop 2
SYMATTR InstName R3
SYMATTR Value 10
SYMBOL res 688 256 R90
WINDOW 0 0 56 VBottom 2
WINDOW 3 32 56 VTop 2
SYMATTR InstName R4
SYMATTR Value 10
SYMBOL cap 672 64 R0
SYMATTR InstName C3
SYMATTR Value 10p
SYMBOL cap 672 304 R0
SYMATTR InstName C4
SYMATTR Value 10p
TEXT 144 -48 Left 2 !.param CDT={DT/(0.691*1k)}

comptof.asc, the sub-circuit schematic file:
Version 4
SHEET 1 880 680
WIRE 64 192 -16 192
WIRE 224 192 144 192
WIRE -304 336 -368 336
WIRE -128 336 -176 336
WIRE 32 336 -48 336
WIRE -304 368 -304 336
WIRE 32 368 32 336
WIRE -176 384 -176 336
WIRE -304 496 -304 448
WIRE -176 496 -176 448
WIRE -176 496 -304 496
WIRE 32 496 32 448
WIRE 32 496 -176 496
WIRE 32 528 32 496
FLAG -16 192 NINV
IOPIN -16 192 In
FLAG 224 192 HYS
FLAG 32 528 0
FLAG -176 336 OUT
IOPIN -176 336 Out
FLAG -368 336 INV
IOPIN -368 336 In
SYMBOL bv 160 192 R90
WINDOW 0 -32 56 VBottom 2
WINDOW 3 32 56 VTop 2
SYMATTR InstName B1
SYMATTR Value V=IF(V(out) > ({VHIGH}+{VLOW})/2,{VHYS},0)
SYMBOL bv 32 352 R0
WINDOW 0 40 40 Left 2
WINDOW 3 42 70 Left 2
SYMATTR InstName B2
SYMATTR Value V=IF(V(HYS,INV)>0,{VHIGH},{VLOW})
SYMBOL res -32 320 R90
WINDOW 0 0 56 VBottom 2
WINDOW 3 32 56 VTop 2
SYMATTR InstName R1
SYMATTR Value 10
SYMBOL cap -192 384 R0
SYMATTR InstName C1
SYMATTR Value 10p
SYMBOL res -320 352 R0
SYMATTR InstName R2
SYMATTR Value 1Meg

The netlist it stands for:
* 3-phase PFC with switches.asc
Va a N SINE(0 {Vgpeak} {FLINE})
Vb b N SINE(0 {Vgpeak} {FLINE} 0 0 120)
Vc c N SINE(0 {Vgpeak} {FLINE} 0 0 240)
R1 N 0 1G
rla N005 N008 10m
rlb N006 N009 10m
rlc N007 N010 10m
H1 ia 0 VIa 80m
H2 ib 0 VIb 80m
H3 ic 0 VIc 80m
La N001 N005 500µ
Lb N002 N006 500µ
Lc N003 N007 500µ
VIa a N008 0
VIb b N009 0
VIc c N010 0
Sap N001 Vout Sap 0 TOFSW
San 0 N001 San 0 TOFSW
Sbp N002 Vout Sbp 0 TOFSW
Sbn 0 N002 Sbn 0 TOFSW
Scp N003 Vout Scp 0 TOFSW
Scn 0 N003 Scn 0 TOFSW
C1 Vout N004 820µ IC=0
R2 N004 0 2m
R4 Vout FB {Rupper}
R5 FB 0 {Rlower}
E1 va 0 a N 1
E2 vb 0 b N 1
E3 vc 0 c N 1
XX1 va vb vc theta theta_sub  ; pins Va Vb Vc theta
XX2 ia ib ic theta N018 N016 N022 dq0_sub  ; pins Ia Ib Ic theta I0 Id Iq
R6 N011 N012 {R2V}
C2 N012 FB {C1V}
C3 N011 FB {C2V}
V3 N013 0 {Vref}
R7 N015 N017 {R2d}
C4 N017 N014 {C1d}
C6 N015 N014 {C2d}
R8 0 N018 1Meg
R9 N015 N016 {Rdd}
R10 N025 N026 {R2q}
C5 N026 N021 {C1q}
C7 N025 N021 {C2q}
R11 N025 N022 {Rdq}
XX3 N014 N021 theta 0 N020 N023 N024 inverse_dq0 params: CLP=2.9 CLN=-2.9
V4 N019 0 PULSE(-3 3 0 16.6u 16.6u 1p 33.33u)
XX4 da San Sap dt_driver params: DT=300n
XX5 db Sbn Sbp dt_driver params: DT=300n
XX6 dc Scn Scp dt_driver params: DT=300n
R12 theta 0 1Meg
XX7 N019 N020 da comptof params: VHIGH=5 VLOW=100m VHYS=10m
XX8 N019 N023 db comptof params: VHIGH=5 VLOW=100m VHYS=10m
XX9 N019 N024 dc comptof params: VHIGH=5 VLOW=100m VHYS=10m
XX10 FB N013 N011 opampTOF params: VHIGH=5 VLOW=100m  ; pins - + OUT
XX11 N015 N011 N014 opampTOF params: VHIGH=5 VLOW=-5  ; pins - + OUT
XX12 N025 0 N021 opampTOF params: VHIGH=5 VLOW=-5  ; pins - + OUT
R13 Vout 0 {RL}
D1 N001 Vout TOFD
D2 0 N001 TOFD
D3 N002 Vout TOFD
D4 0 N002 TOFD
D5 N003 Vout TOFD
D6 0 N003 TOFD

* block symbol definitions
.subckt inverse_dq0 d q theta zero Ia Ib Ic
R1 d 0 1Meg
R2 q 0 1Meg
R3 zero 0 1Meg
B1 IaC 0 V=((sin(V(theta))*V(d))+(cos(V(theta))*V(q))+(V(zero)/sqrt(2)))*sqrt(2/3)
B2 IbC 0 V=((sin(V(theta)-2*pi/3)*V(d))+(cos(V(theta)-2*pi/3)*V(q))+(V(zero)/sqrt(2)))*sqrt(2/3)
R4 theta 0 1Meg
B3 IcC 0 V=((sin(V(theta)+2*pi/3)*V(d))+(cos(V(theta)+2*pi/3)*V(q))+(V(zero)/sqrt(2)))*sqrt(2/3)
B4 N001 0 V=IF(V(IaC)>{CLP},{CLP},IF(V(Iac)<{CLN},{CLN},V(IaC)))
B5 N002 0 V=IF(V(IbC)>{CLP},{CLP},IF(V(Ibc)<{CLN},{CLN},V(IbC)))
B6 N003 0 V=IF(V(IcC)>{CLP},{CLP},IF(V(IcC)<{CLN},{CLN},V(IcC)))
R5 Ia N001 1k
R6 Ic N003 1k
R7 Ib N002 1k
C1 Ia 0 10p
C2 Ic 0 10p
C3 Ib 0 10p
.ends inverse_dq0

.subckt dt_driver IN OutN OutP
A1 IN 0 0 0 0 N004 N001 0 BUF Vhigh=5 Vlow=0 Ref=1.0
R1 N003 N001 1k
C1 N003 0 {CDT}
R2 N006 N004 1k
C2 N006 0 {CDT}
A2 0 N001 0 N003 0 0 N002 0 AND Vhigh=5 Vlow=0 Ref=2.5
A3 0 N004 0 N006 0 0 N005 0 AND Vhigh=5 Vlow=0 Ref=2.5
D1 N003 N001 1N4148
D2 N006 N004 D
R3 OutN N002 10
R4 OutP N005 10
C3 OutN 0 10p
C4 OutP 0 10p
.param CDT={DT/(0.691*1k)}
.ends dt_driver

.subckt comptof INV NINV OUT
B1 HYS NINV V=IF(V(out) > ({VHIGH}+{VLOW})/2,{VHYS},0)
B2 N001 0 V=IF(V(HYS,INV)>0,{VHIGH},{VLOW})
R1 N001 OUT 10
C1 OUT 0 10p
R2 INV 0 1Meg
.ends comptof

.model D D
.lib standard.dio
*
.PARAM Fline=50
.param Vgrms=120
.PARAM Vgpeak={Vgrms*sqrt(2)}
.PARAM Vamp={Vgpeak*2}
.MODEL TOFSW SW(Ron=25m Roff=10Meg Vt=2 Vh=1)
.MODEL TOFD D(IS=10e-18 RS=16m CJO=500p
+M=0.4 VJ=0.75 ISR=720n BV=1000 IBV=100u TT=130n)
*
.tran 0 300m 200m uic
.param GfcV=20 ; magnitude at crossover *
.param PSV=-90 ; phase lag at crossover *
*
* Enter Design Goals Information Here *
*
.param fcV=20 ; targeted crossover *
.param PMV=60 ; choose phase margin at crossover *
*
* Enter the Values for Vout and Bridge Bias Current *
*
.param Vout=400
.param Pout=10k ; nominal is 5 kW
.param RL={(Vout)**2/(Pout)}
.param Ibias=100u
.param Vref=2.5
.param Rlower={Vref/Ibias}
.param Rupper={(Vout-Vref)/Ibias}
*
* Do not edit the below lines *
.param boostV={PMV-PSV-90}
.param GV={10**(-GfcV/20)}
.param kV={tan((boostV/2+45)*pi/180)}
.param fpV={fcV*kV}
.param fzV={fcV/kV}
.param C2V={1/(2*pi*fcV*GV*kV*Rupper)}
.param C1V={C2V*(kV**2-1)}
.param R2V={kV/(C1V*2*pi*fcV)}
*
* Components for the d loop *
.param Gfcd=0 ; magnitude at crossover *
.param PSd=-100 ; phase lag at crossover *
*
* Enter Design Goals Information Here *
*
.param fcd=2k ; targeted crossover *
.param PMd=60 ; choose phase margin at crossover *
*
* Enter the Values for Vout and Bridge Bias Current *
*
.param Rdd=100k
*
* Do not edit the below lines *
.param boostd={PMd-PSd-90}
.param Gd={10**(-Gfcd/20)}
.param kd={tan((boostd/2+45)*pi/180)}
.param fpd={fcd*kd}
.param fzd={fcd/kd}
.param C2d={1/(2*pi*fcd*Gd*kd*Rdd)}
.param C1d={C2d*(kd**2-1)}
.param R2d={kd/(C1d*2*pi*fcd)}
*
* Components for the q loop *
.param Gfcq=0 ; magnitude at crossover *
.param PSq=-100 ; phase lag at crossover *
*
* Enter Design Goals Information Here *
*
.param fcq=2k ; targeted crossover *
.param PMq=60 ; choose phase margin at crossover *
*
.param Rdq=100k
*
* Do not edit the below lines *
.param boostq={PMq-PSq-90}
.param Gq={10**(-Gfcq/20)}
.param kq={tan((boostq/2+45)*pi/180)}
.param fpq={fcq*kq}
.param fzq={fcq/kq}
.param C2q={1/(2*pi*fcq*Gq*kq*Rdq)}
.param C1q={C2d*(kq**2-1)}
.param R2q={kq/(C1q*2*pi*fcq)}
*
.four 50 10 -1 I(Via)
.four 50 10 -1 I(Vib)
.four 50 10 -1 I(Vic)
.options abstol=1u vntol=1m reltol=0.01 gmin=100p
+method=gear
.backanno
.end